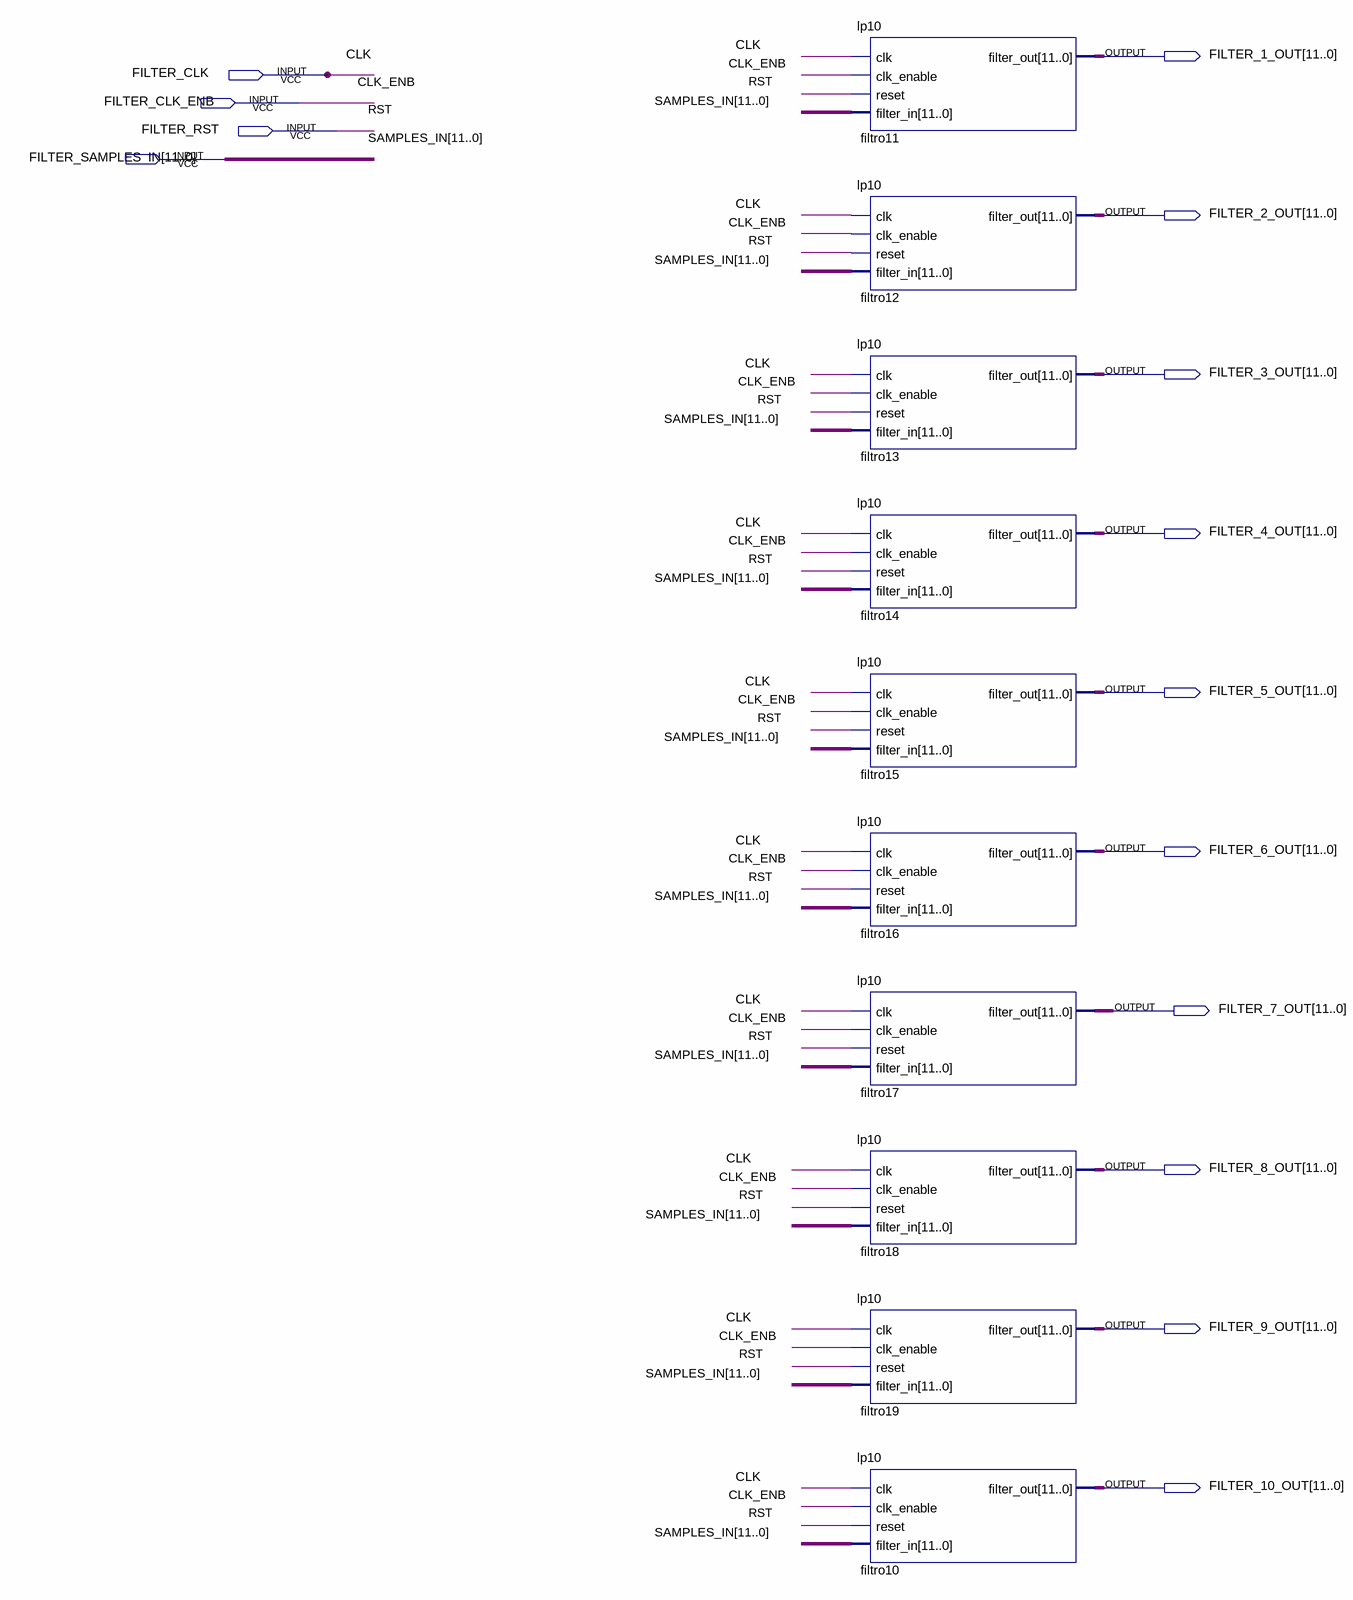
[diagram p0: schematic sheet]
// Quartus schematic FilterBank.bdf as structural Verilog: 10 symbols, 14 pins
module FilterBank (
  input  FILTER_CLK,
  input  FILTER_CLK_ENB,
  input  FILTER_RST,
  input  [11:0] FILTER_SAMPLES_IN,
  output [11:0] FILTER_1_OUT,
  output [11:0] FILTER_2_OUT,
  output [11:0] FILTER_3_OUT,
  output [11:0] FILTER_4_OUT,
  output [11:0] FILTER_5_OUT,
  output [11:0] FILTER_6_OUT,
  output [11:0] FILTER_7_OUT,
  output [11:0] FILTER_8_OUT,
  output [11:0] FILTER_9_OUT,
  output [11:0] FILTER_10_OUT
);

  lp10 filtro11 (
    .clk(FILTER_CLK), .clk_enable(FILTER_CLK_ENB), .reset(FILTER_RST), .filter_in(FILTER_SAMPLES_IN),
    .filter_out(FILTER_1_OUT));
  lp10 filtro12 (
    .clk(FILTER_CLK), .clk_enable(FILTER_CLK_ENB), .reset(FILTER_RST), .filter_in(FILTER_SAMPLES_IN),
    .filter_out(FILTER_2_OUT));
  lp10 filtro13 (
    .clk(FILTER_CLK), .clk_enable(FILTER_CLK_ENB), .reset(FILTER_RST), .filter_in(FILTER_SAMPLES_IN),
    .filter_out(FILTER_3_OUT));
  lp10 filtro14 (
    .clk(FILTER_CLK), .clk_enable(FILTER_CLK_ENB), .reset(FILTER_RST), .filter_in(FILTER_SAMPLES_IN),
    .filter_out(FILTER_4_OUT));
  lp10 filtro15 (
    .clk(FILTER_CLK), .clk_enable(FILTER_CLK_ENB), .reset(FILTER_RST), .filter_in(FILTER_SAMPLES_IN),
    .filter_out(FILTER_5_OUT));
  lp10 filtro16 (
    .clk(FILTER_CLK), .clk_enable(FILTER_CLK_ENB), .reset(FILTER_RST), .filter_in(FILTER_SAMPLES_IN),
    .filter_out(FILTER_6_OUT));
  lp10 filtro17 (
    .clk(FILTER_CLK), .clk_enable(FILTER_CLK_ENB), .reset(FILTER_RST), .filter_in(FILTER_SAMPLES_IN),
    .filter_out(FILTER_7_OUT));
  lp10 filtro18 (
    .clk(FILTER_CLK), .clk_enable(FILTER_CLK_ENB), .reset(FILTER_RST), .filter_in(FILTER_SAMPLES_IN),
    .filter_out(FILTER_8_OUT));
  lp10 filtro19 (
    .clk(FILTER_CLK), .clk_enable(FILTER_CLK_ENB), .reset(FILTER_RST), .filter_in(FILTER_SAMPLES_IN),
    .filter_out(FILTER_9_OUT));
  lp10 filtro10 (
    .clk(FILTER_CLK), .clk_enable(FILTER_CLK_ENB), .reset(FILTER_RST), .filter_in(FILTER_SAMPLES_IN),
    .filter_out(FILTER_10_OUT));

  // Other names for the same wires on the sheet: CLK_ENB = FILTER_CLK_ENB; CLK = FILTER_CLK; RST = FILTER_RST;
  //   SAMPLES_IN[11:0] = FILTER_SAMPLES_IN
endmodule
